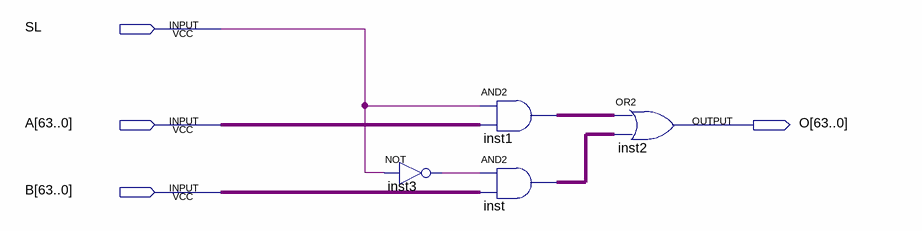
[diagram p0: schematic sheet]
// Quartus schematic 21MUX64Bit.bdf as structural Verilog: 4 symbols, 4 pins
module \21MUX64Bit  (
  input  SL,
  input  [63:0] A,
  input  [63:0] B,
  output [63:0] O
);

  wire inst3_out;
  wire [63:0] inst1_out, inst_out;

  not inst3 (inst3_out, SL);
  assign inst1_out = {64{SL}} & A;  // AND2 inst1, 64 bits wide
  assign inst_out = {64{inst3_out}} & B;  // AND2 inst, 64 bits wide
  assign O = inst1_out | inst_out;  // OR2 inst2, 64 bits wide
endmodule
